# Altium schematic sheet usb_jtag.SchDoc
size 340 x 190 mm; SheetNumber: 3; SheetTotal: 13
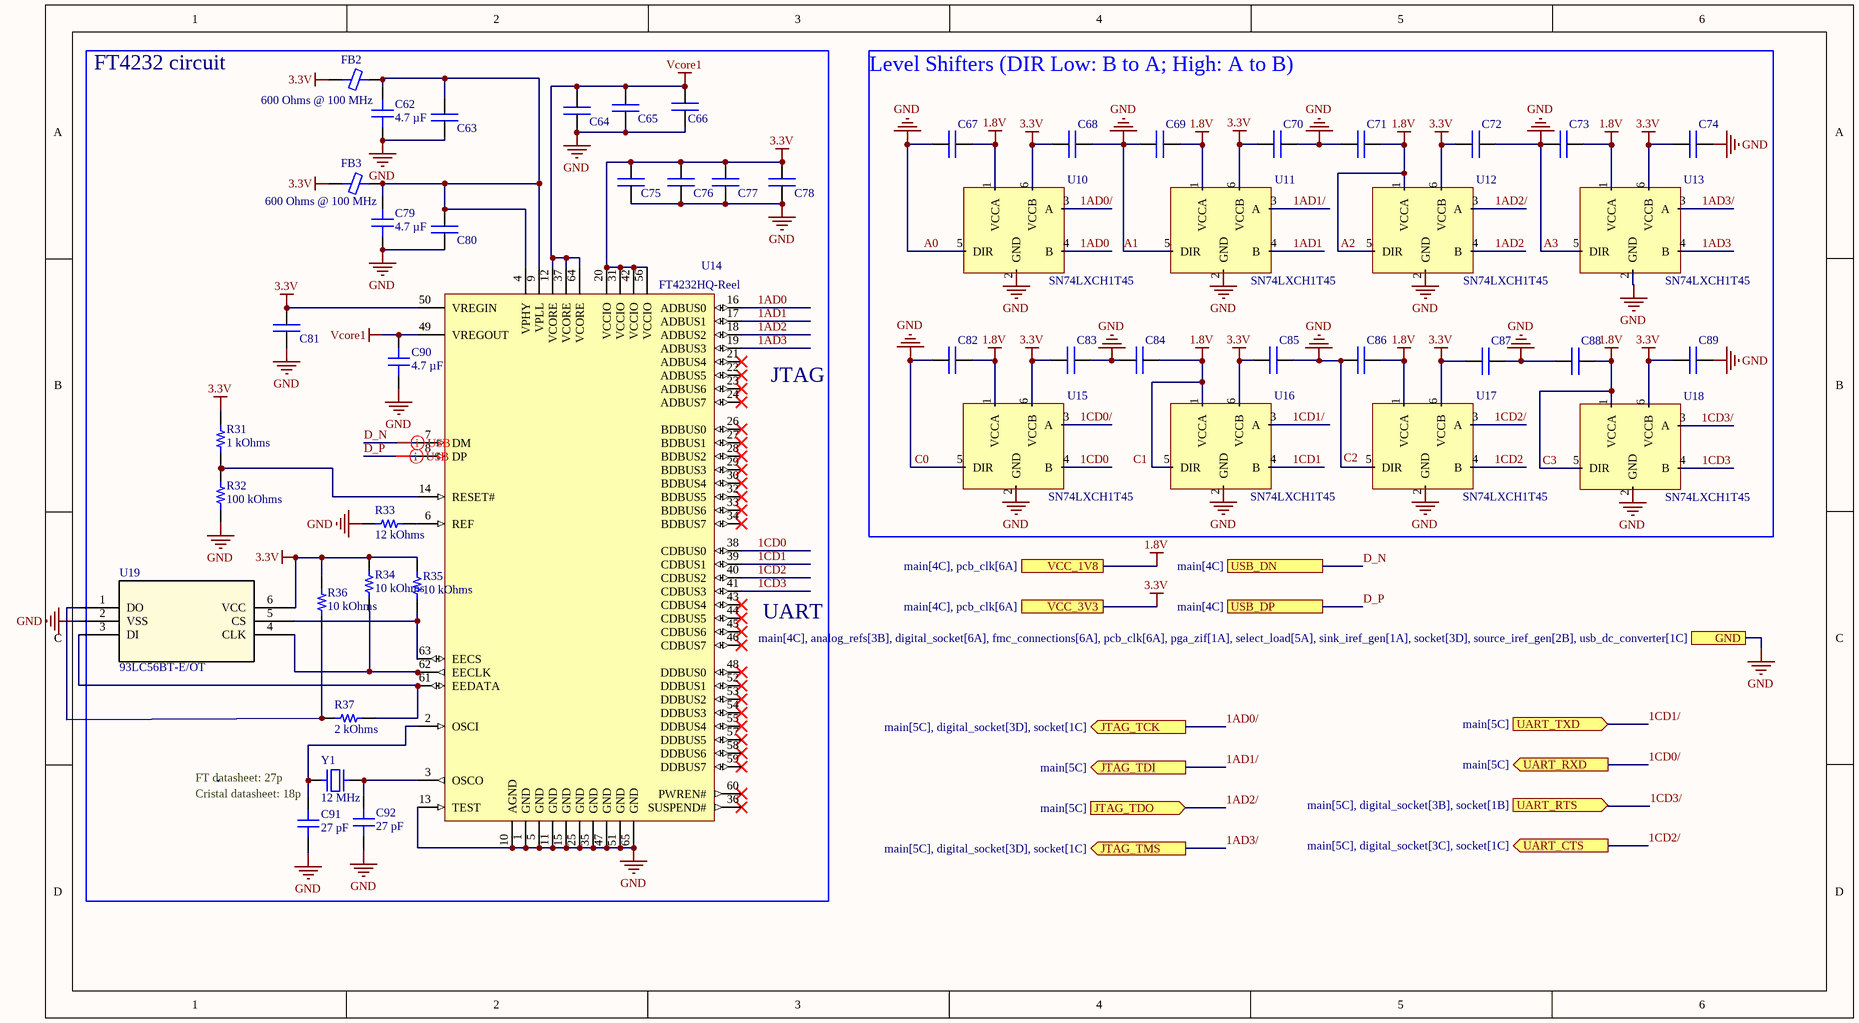
[diagram p0: usb_jtag.SchDoc]

## Parts
C62  4.7 µF  [CAP 0805_2012]
C63  CSMD402/100nF  [smd C0402]  (value not drawn)
C64  CSMD402/100nF  [smd C0402]  (value not drawn)
C65  CSMD402/100nF  [smd C0402]  (value not drawn)
C66  CSMD402/100nF  [smd C0402]  (value not drawn)
C67  CSMD402/100nF  [smd C0402]  (value not drawn)
C68  CSMD402/100nF  [smd C0402]  (value not drawn)
C69  CSMD402/100nF  [smd C0402]  (value not drawn)
C70  CSMD402/100nF  [smd C0402]  (value not drawn)
C71  CSMD402/100nF  [smd C0402]  (value not drawn)
C72  CSMD402/100nF  [smd C0402]  (value not drawn)
C73  CSMD402/100nF  [smd C0402]  (value not drawn)
C74  CSMD402/100nF  [smd C0402]  (value not drawn)
C75  CSMD402/100nF  [smd C0402]  (value not drawn)
C76  CSMD402/100nF  [smd C0402]  (value not drawn)
C77  CSMD402/100nF  [smd C0402]  (value not drawn)
C78  CSMD402/100nF  [smd C0402]  (value not drawn)
C79  4.7 µF  [CAP 0805_2012]
C80  CSMD402/100nF  [smd C0402]  (value not drawn)
C81  CSMD402/100nF  [smd C0402]  (value not drawn)
C82  CSMD402/100nF  [smd C0402]  (value not drawn)
C83  CSMD402/100nF  [smd C0402]  (value not drawn)
C84  CSMD402/100nF  [smd C0402]  (value not drawn)
C85  CSMD402/100nF  [smd C0402]  (value not drawn)
C86  CSMD402/100nF  [smd C0402]  (value not drawn)
C87  CSMD402/100nF  [smd C0402]  (value not drawn)
C88  CSMD402/100nF  [smd C0402]  (value not drawn)
C89  CSMD402/100nF  [smd C0402]  (value not drawn)
C90  4.7 µF  [CAP 0805_2012]
C91  27 pF  [CAP 0805_2012]
C92  27 pF  [CAP 0805_2012]
FB2  600 Ohms @ 100 MHz  [FER 0805_2012]
FB3  600 Ohms @ 100 MHz  [FER 0805_2012]
R31  1 kOhms  [RES 0805_2012]
R32  100 kOhms  [RES 0805_2012]
R33  12 kOhms  [YAGEO RES 0805_2012]
R34  10 kOhms  [RES 0805_2012]
R35  10 kOhms  [RES 0805_2012]
R36  10 kOhms  [RES 0805_2012]
R37  2 kOhms  [YAGEO RES 0805_2012]
U10  SN74LXCH1T45  [SC70 - duplicate]
U11  SN74LXCH1T45  [SC70 - duplicate]
U12  SN74LXCH1T45  [SC70 - duplicate]
U13  SN74LXCH1T45  [SC70 - duplicate]
U14  FT4232HQ-Reel  [QFN64_2_L]
U15  SN74LXCH1T45  [SC70 - duplicate]
U16  SN74LXCH1T45  [SC70 - duplicate]
U17  SN74LXCH1T45  [SC70 - duplicate]
U18  SN74LXCH1T45  [SC70 - duplicate]
U19  93LC56BT-E/OT  [SOT-23-6_MC_MCH]
Y1  12 MHz  [ABRACON ABLS]

## Blocks framed on the sheet
Level Shifters (DIR Low: B to A; High: A to B): C67-C74 C82-C89 U10-U13 U15-U18

## Ports
GND (see main[4C], analog_refs[3B], digital_socket[6A], fmc_connections[6A], pcb_clk[6A], pga_zif[1A], select_load[5A], sink_iref_gen[1A], socket[3D], source_iref_gen[2B], usb_dc_converter[1C]), JTAG_TCK (out, see main[5C], digital_socket[3D], socket[1C]), JTAG_TDI (out, see main[5C]), JTAG_TDO (in, see main[5C]), JTAG_TMS (out, see main[5C], digital_socket[3D], socket[1C]), UART_CTS (out, see main[5C], digital_socket[3C], socket[1C]), UART_RTS (in, see main[5C], digital_socket[3B], socket[1B]), UART_RXD (out, see main[5C]), UART_TXD (in, see main[5C]), USB_DN (see main[4C]), USB_DP (see main[4C]), VCC_1V8 (see main[4C], pcb_clk[6A]), VCC_3V3 (see main[4C], pcb_clk[6A])

## Nets
3.3V: C68.2 C70.2 C72.2 C74.2 C75.1 C76.2 C77.2 C78.2 C81.2 C83.2 C85.2 C87.2 C89.2 FB2.1 FB3.1 R31.2 R34.1 R35.1 R36.1 U10.6(VCCB) U11.6(VCCB) U12.6(VCCB) U13.6(VCCB) U14.20(VCCIO) U14.31(VCCIO) U14.42(VCCIO) U14.50(VREGIN) U14.56(VCCIO) U15.6(VCCB) U16.6(VCCB) U17.6(VCCB) U18.6(VCCB) U19.6(VCC) ; port VCC_3V3
A0: C62.1 C63.1 C64.1 C65.1 C66.2 C67.2 C68.1 C69.2 C70.1 C71.2 C72.1 C73.2 C74.1 C75.2 C76.1 C77.1 C78.1 C79.1 C80.1 C81.1 C82.2 C83.1 C84.2 C85.1 C86.2 C87.1 C88.2 C89.1 C90.1 C91.1 C92.1 R32.1 R33.1 U10.2(GND) U10.5(DIR) U11.2(GND) U11.5(DIR) U12.2(GND) U13.2(GND) U13.5(DIR) U14.1(GND) U14.5(GND) U14.10(AGND) U14.11(GND) U14.13(TEST) U14.15(GND) U14.25(GND) U14.35(GND) U14.47(GND) U14.51(GND) U14.65(GND) U15.2(GND) U15.5(DIR) U16.2(GND) U17.2(GND) U17.5(DIR) U18.2(GND) U19.2(VSS) ; port GND  [also labelled A1, A3, C0, GND]
A2: C67.1 C69.1 C71.1 C73.1 C82.1 C84.1 C86.1 C88.1 U10.1(VCCA) U11.1(VCCA) U12.1(VCCA) U12.5(DIR) U13.1(VCCA) U15.1(VCCA) U16.1(VCCA) U16.5(DIR) U17.1(VCCA) U18.1(VCCA) U18.5(DIR) ; port VCC_1V8  [also labelled 1.8V, C3]
Vcore1: C64.2 C65.2 C66.1 C90.2 U14.12(VCORE) U14.37(VCORE) U14.49(VREGOUT) U14.64(VCORE)
1AD0: U10.4(B) U14.16(ADBUS0)
1AD0/: U10.3(A) ; port JTAG_TCK
1AD1: U11.4(B) U14.17(ADBUS1)
1AD1/: U11.3(A) ; port JTAG_TDI
1AD2: U12.4(B) U14.18(ADBUS2)
1AD2/: U12.3(A) ; port JTAG_TDO
1AD3: U13.4(B) U14.19(ADBUS3)
1AD3/: U13.3(A) ; port JTAG_TMS
1CD0: U14.38(CDBUS0) U15.4(B)
1CD0/: U15.3(A) ; port UART_RXD
1CD1: U14.39(CDBUS1) U16.4(B)
1CD1/: U16.3(A) ; port UART_TXD
1CD2: U14.40(CDBUS2) U17.4(B)
1CD2/: U17.3(A) ; port UART_CTS
1CD3: U14.41(CDBUS3) U18.4(B)
1CD3/: U18.3(A) ; port UART_RTS
D_N: U14.7(DM) ; port USB_DN
D_P: U14.8(DP) ; port USB_DP
NetC62_2: C62.2 C63.2 C79.2 C80.2 FB2.2 FB3.2 U14.4(VPHY) U14.9(VPLL)
NetC91_2: C91.2 U14.2(OSCI) Y1.1
NetC92_2: C92.2 U14.3(OSCO) Y1.2
NetR31_1: R31.1 R32.2 U14.14(RESET#)
NetR33_2: R33.2 U14.6(REF)
NetR34_2: R34.2 U14.62(EECLK) U19.4(CLK)
NetR35_2: R35.2 U14.63(EECS) U19.5(CS)
NetR36_2: R36.2 R37.1 U19.1(DO)
NetR37_2: R37.2 U14.61(EEDATA) U19.3(DI)

Not connected (* = marked no-connect by the designer): U14 21(ADBUS4)* 22(ADBUS5)* 23(ADBUS6)* 24(ADBUS7)* 26(BDBUS0)* 27(BDBUS1)* 28(BDBUS2)* 29(BDBUS3)* 30(BDBUS4)* 32(BDBUS5)* 33(BDBUS6)* 34(BDBUS7)* 36(SUSPEND#)* 43(CDBUS4)* 44(CDBUS5)* 45(CDBUS6)* 46(CDBUS7)* 48(DDBUS0)* 52(DDBUS1)* 53(DDBUS2)* 54(DDBUS3)* 55(DDBUS4)* 57(DDBUS5)* 58(DDBUS6)* 59(DDBUS7)* 60(PWREN#)*

## Layout directives
differential pair: D_N, D_P

## Notes on the sheet
- FT4232 circuit
- JTAG
- (near U14) UART
- FT datasheet: 27p
- Cristal datasheet: 18p
- Labels drawn without touching a wire or pin: C1, C2

## Library data of the parts
C62 C79 C90 = 0805B475K100CT: CAP CER 4.7UF 10V X7R 0805; manufacturer: Walsin Technology Corporation; Tolerance: ±10%; Part Number: 0805B475K100CT; Capacitance: 4.7 µF; Applications: General Purpose; componentlink1description: Datasheet; componentlink1url: https://www.passivecomponent.com/wp-content/uploads/datasheet/WTC_MLCC_General_Purpose.pdf; componentlink2description: DigiKey Link; componentlink2url: https://www.digikey.com/en/products/detail/walsin-technology-corporation/0805B475K100CT/15987965; Device Package: 0805 (2012 Metric); lastupdated: 4/6/2026 7:29:10 PM; Lifecycle Status: Active; Minimum Order: 1; Mounting Type: Surface Mount, MLCC; Operating Temperature: -55°C ~ 125°C; Package / Case: 0805 (2012 Metric); packaging: TapeAndReel; partid: 72231; price: 0.02; series: -; Size / Dimension: 0.079" L x 0.049" W (2.00mm x 1.25mm); Supplier 1: DigiKey; Supplier Part Number 1: 1292-0805B475K100CT-ND; Temperature Coefficient: X7R; Thickness (Max): 0.057" (1.45mm); value: 4.7 µF; Voltage - Rated: 10V
C63-C78 C80-C89 = CSMD402/100nF: smd capaciteit, verp.0402, 100nF; Part Number: CSMD402/100nF; Supplier 1: Farnell; Component Kind: Standard; Component Type: Standard; Pin Count: 2
C91 C92 = 251R15S270GV4E: CAP CER 27PF 250V NP0 0805; manufacturer: Johanson Technology Inc.; Temperature Coefficient: C0G, NP0; Tolerance: ±2%; Part Number: 251R15S270GV4E; Capacitance: 27 pF; Applications: RF, Microwave, High Frequency; componentlink1description: Datasheet; componentlink1url: https://www.johansontechnology.com/downloads/catalog/johanson-technology-multi-layer-high-q-capacitors.pdf; componentlink2description: DigiKey Link; componentlink2url: https://www.digikey.com/en/products/detail/johanson-technology-inc/251R15S270GV4E/1919491; Device Package: 0805 (2012 Metric); Features: High Q, Low Loss, Ultra Low ESR; lastupdated: 4/6/2026 7:32:15 PM; Lifecycle Status: Active; Minimum Order: 1; Mounting Type: Surface Mount, MLCC; Operating Temperature: -55°C ~ 125°C; Package / Case: 0805 (2012 Metric); packaging: TapeAndReel; partid: 18397; Part Status: Active; price: 0.14; series: S; Size / Dimension: 0.080" L x 0.050" W (2.03mm x 1.27mm); Supplier 1: DigiKey; Supplier Part Number 1: 712-1738-1-ND; Thickness (Max): 0.046" (1.17mm); value: 27 pF; Voltage - Rated: 250V
FB2 FB3 = BLM21HE601SH1L: FERRITE BEAD 600 OHM 0805 1LN; Manufacturer: Murata Electronics; Current Rating (Max): 2.3A; DC Resistance (DCR) (Max): 55mOhm; Filter Type: Signal Line; Number of Lines: 1; Part Number: BLM21HE601SH1L; ComponentLink2Description: DigiKey Link; ComponentLink2URL: https://www.digikey.com/en/products/detail/murata-electronics/BLM21HE601SH1L/17184949; Device Package: 0805 (2012 Metric); Features: Automotive; Height (Max): 0.057" (1.45mm); Impedance @ Frequency: 600 Ohms @ 100 MHz; LastUpdated: 4/5/2026 8:28:54 PM; Lifecycle Status: Active; Minimum Order: 1; Mounting Type: Surface Mount; Operating Temperature: -55°C ~ 125°C; Package / Case: 0805 (2012 Metric); Packaging: TapeAndReel; PartId: 3271; Part Status: Active; Price: 0.12; Ratings: AEC-Q200; Series: BLM21H; Size / Dimension: 0.079" L x 0.049" W (2.00mm x 1.25mm); Supplier 1: DigiKey; Supplier Part Number 1: 490-BLM21HE601SH1LCT-ND; Value: 600 Ohms @ 100 MHz
R31 = CHP0805AFX-1001ELF: RESHIGHPOWERA 0805 1K 1% 1/2W TC; Manufacturer: Bourns Inc.; Power (Watts): 0.5W, 1/2W; Temperature Coefficient: ±100ppm/°C; Part Number: CHP0805AFX-1001ELF; Value: 1 kOhms; ComponentLink1Description: Datasheet; ComponentLink1URL: https://www.bourns.com/docs/product-datasheets/chp-a.pdf; ComponentLink2Description: DigiKey Link; ComponentLink2URL: https://www.digikey.com/en/products/detail/bourns-inc/CHP0805AFX-1001ELF/12144379; Composition: Thick Film; Device Package: 0805 (2012 Metric); Features: Anti-Sulfur, Automotive AEC-Q200, Moisture Resistant, Pulse Withstanding; Height - Seated (Max): 0.024" (0.60mm); LastUpdated: 4/5/2026 8:09:01 PM; Lifecycle Status: Active; Minimum Order: 1; Number of Terminations: 2; Operating Temperature: -55°C ~ 155°C; Package / Case: 0805 (2012 Metric); Packaging: TapeAndReel; PartId: 66642; Part Status: Active; Price: 0.08; Ratings: AEC-Q200; Resistance: 1 kOhms; Series: CHP-A; Size / Dimension: 0.079" L x 0.049" W (2.00mm x 1.25mm); Supplier 1: DigiKey; Supplier Part Number 1: 118-CHP0805AFX-1001ELFCT-ND; Supplier Device Package: 0805; Tolerance: ±1%
R32 = 3430A2F100KTDF: 3430 A2 1% 100K 100PPM 1K RL; Manufacturer: TE Connectivity Passive Product; Power (Watts): 1W; Temperature Coefficient: ±100ppm/°C; Part Number: 3430A2F100KTDF; Value: 100 kOhms; ComponentLink1Description: Datasheet; ComponentLink1URL: https://www.te.com/usa-en/product-4-2176559-1.datasheet.pdf; ComponentLink2Description: DigiKey Link; ComponentLink2URL: https://www.digikey.com/en/products/detail/te-connectivity-passive-product/3430A2F100KTDF/17763668; Composition: Thick Film; Device Package: 0805 (2012 Metric); Features: Automotive AEC-Q200; Height - Seated (Max): 0.026" (0.65mm); LastUpdated: 4/5/2026 8:08:27 PM; Lifecycle Status: Active; Minimum Order: 1; Number of Terminations: 2; Operating Temperature: -55°C ~ 155°C; Package / Case: 0805 (2012 Metric); Packaging: TapeAndReel; PartId: 78438; Part Status: Active; Price: 0.02; Ratings: AEC-Q200; Resistance: 100 kOhms; Series: 3430; Size / Dimension: 0.049" L x 0.079" W (1.25mm x 2.00mm); Supplier 1: DigiKey; Supplier Part Number 1: 1712-3430A2F100KTDFCT-ND; Supplier Device Package: 0508; Tolerance: ±1%
R33 = AC0805FR-0712KL: RES SMD 12K OHM 1% 1/8W 0805; Manufacturer: Yageo; Power (Watts): 0.125W, 1/8W; Temperature Coefficient: ±100ppm/°C; Part Number: AC0805FR-0712KL; Value: 12 kOhms; ComponentLink1Description: Datasheet; ComponentLink1URL: https://www.yageo.com/upload/media/product/productsearch/datasheet/rchip/PYu-AC_51_RoHS_L_7.pdf; ComponentLink2Description: DigiKey Link; ComponentLink2URL: https://www.digikey.com/en/products/detail/yageo/AC0805FR-0712KL/5896550; Composition: Thick Film; Device Package: 0805 (2012 Metric); Features: Automotive AEC-Q200, Moisture Resistant; Height - Seated (Max): 0.024" (0.60mm); LastUpdated: 4/5/2026 9:18:17 PM; Lifecycle Status: Active; Minimum Order: 1; Number of Terminations: 2; Operating Temperature: -55°C ~ 155°C; Package / Case: 0805 (2012 Metric); Packaging: TapeAndReel; PartId: 31694; Part Status: Active; Price: 0.01; Ratings: AEC-Q200; Resistance: 12 kOhms; Series: AC; Size / Dimension: 0.079" L x 0.049" W (2.00mm x 1.25mm); Supplier 1: DigiKey; Supplier Part Number 1: YAG3692CT-ND; Supplier Device Package: 0805; Tolerance: ±1%
R34-R36 = 9-2176375-1: RES 10K OHM 0.1% 1/5W 0805; Manufacturer: TE Connectivity Passive Product; Power (Watts): 0.2W, 1/5W; Temperature Coefficient: ±10ppm/°C; Part Number: 9-2176375-1; Value: 10 kOhms; ComponentLink1Description: Datasheet; ComponentLink1URL: https://www.te.com/usa-en/product-9-2176375-1.datasheet.pdf; ComponentLink2Description: DigiKey Link; ComponentLink2URL: https://www.digikey.com/en/products/detail/te-connectivity-passive-product/9-2176375-1/18110542; Composition: Thin Film; Device Package: 0805 (2012 Metric); Features: Anti-Sulfur, Automotive AEC-Q200, Moisture Resistant; Height - Seated (Max): 0.026" (0.65mm); LastUpdated: 4/5/2026 8:08:39 PM; Lifecycle Status: Active; Minimum Order: 1; Number of Terminations: 2; Operating Temperature: -55°C ~ 155°C; Package / Case: 0805 (2012 Metric); Packaging: TapeAndReel; PartId: 76290; Part Status: Active; Price: 0.35; Ratings: AEC-Q200; Resistance: 10 kOhms; Series: RQ73; Size / Dimension: 0.079" L x 0.049" W (2.00mm x 1.25mm); Supplier 1: DigiKey; Supplier Part Number 1: 1712-9-2176375-1CT-ND; Supplier Device Package: 0805; Tolerance: ±0.1%
R37 = AC0805FR-102KL: RES 2K OHM 1% 1/8W 0805; Manufacturer: Yageo; Power (Watts): 0.125W, 1/8W; Temperature Coefficient: ±100ppm/°C; Part Number: AC0805FR-102KL; Value: 2 kOhms; ComponentLink1Description: Datasheet; ComponentLink1URL: https://www.yageo.com/upload/media/product/productsearch/datasheet/rchip/PYu-AC_51_RoHS_L_8.pdf; ComponentLink2Description: DigiKey Link; ComponentLink2URL: https://www.digikey.com/en/products/detail/yageo/AC0805FR-102KL/14008292; Composition: Thick Film; Device Package: 0805 (2012 Metric); Height - Seated (Max): 0.024" (0.60mm); LastUpdated: 4/5/2026 9:17:54 PM; Lifecycle Status: Active; Minimum Order: 1; Number of Terminations: 2; Operating Temperature: -55°C ~ 155°C; Package / Case: 0805 (2012 Metric); Packaging: TapeAndReel; PartId: 66655; Part Status: Active; Price: 0.01; Ratings: AEC-Q200; Resistance: 2 kOhms; Series: AC; Size / Dimension: 0.079" L x 0.049" W (2.00mm x 1.25mm); Supplier 1: DigiKey; Supplier Part Number 1: 13-AC0805FR-102KLCT-ND; Supplier Device Package: 0805; Tolerance: ±1%
U14 = CMP-0078-00005-3: Quad High Speed USB To Multipurpose UART/MPSSE IC, 64-pin QFN, Tape and Reel; Manufacturer: FTDI; ComponentLink1URL: http://www.ftdichip.com/; ComponentLink2Description: Datasheet; ComponentLink2URL: http://www.ftdichip.com/Support/Documents/DataSheets/ICs/DS_FT4232H.pdf; PackageReference: QFN64_2; DatasheetVersion: ver 2.2, Jan-2012; PackageDescription: 64-Pin Quad Flat No-Lead, 9 x 9 mm Body, 0.5 mm Pitch, 4.35 x 4.35 mm Exposed Pad; RevisionNote: DatasheetVersion updated to 2.2 Jan-2012; PartNumber: FT4232HQ-Reel; PackageVersion: Jan-12; ComponentLink1Description: Manufacturer URL
U19 = 93LC56BT-EOT: Description; Manufacturer_Name: Microchip; Copyright: Copyright (C) 2025 Ultra Librarian. All rights reserved.; Manufacturer_Part_Number: 93LC56BT-E/OT; RefDes: RefDes; Type: Type
Y1 = ABLS-12.000MHZ-B4-T: CRYSTAL 12.0000MHZ 18PF SMD; Manufacturer: Abracon LLC; ESR (Equivalent Series Resistance): 50 Ohms; Frequency Stability: ±50ppm; Frequency Tolerance: ±30ppm; Operating Mode: Fundamental; Part Number: ABLS-12.000MHZ-B4-T; ComponentLink1Description: Datasheet; ComponentLink1URL: https://abracon.com/Resonators/abls.pdf; ComponentLink2Description: DigiKey Link; ComponentLink2URL: https://www.digikey.com/en/products/detail/abracon-llc/ABLS-12-000MHZ-B4-T/2184161; Frequency: 12 MHz; Height - Seated (Max): 0.165" (4.20mm); LastUpdated: 4/5/2026 8:41:04 PM; Lifecycle Status: Active; Load Capacitance: 18pF; Minimum Order: 1; Mounting Type: Surface Mount; Operating Temperature: -20°C ~ 70°C; Package / Case: HC-49/US; Packaging: TapeAndReel; PartId: 90; Part Status: Active; Price: 0.11; Series: ABLS; Size / Dimension: 0.449" L x 0.185" W (11.40mm x 4.70mm); Supplier 1: DigiKey; Supplier Part Number 1: 535-10218-1-ND; Type: MHz Crystal; Value: 12 MHz